# EAGLE schematic vsBenchPowerSupply (EAGLE 7.7.0)

## Sheet 1 of 4: Overview
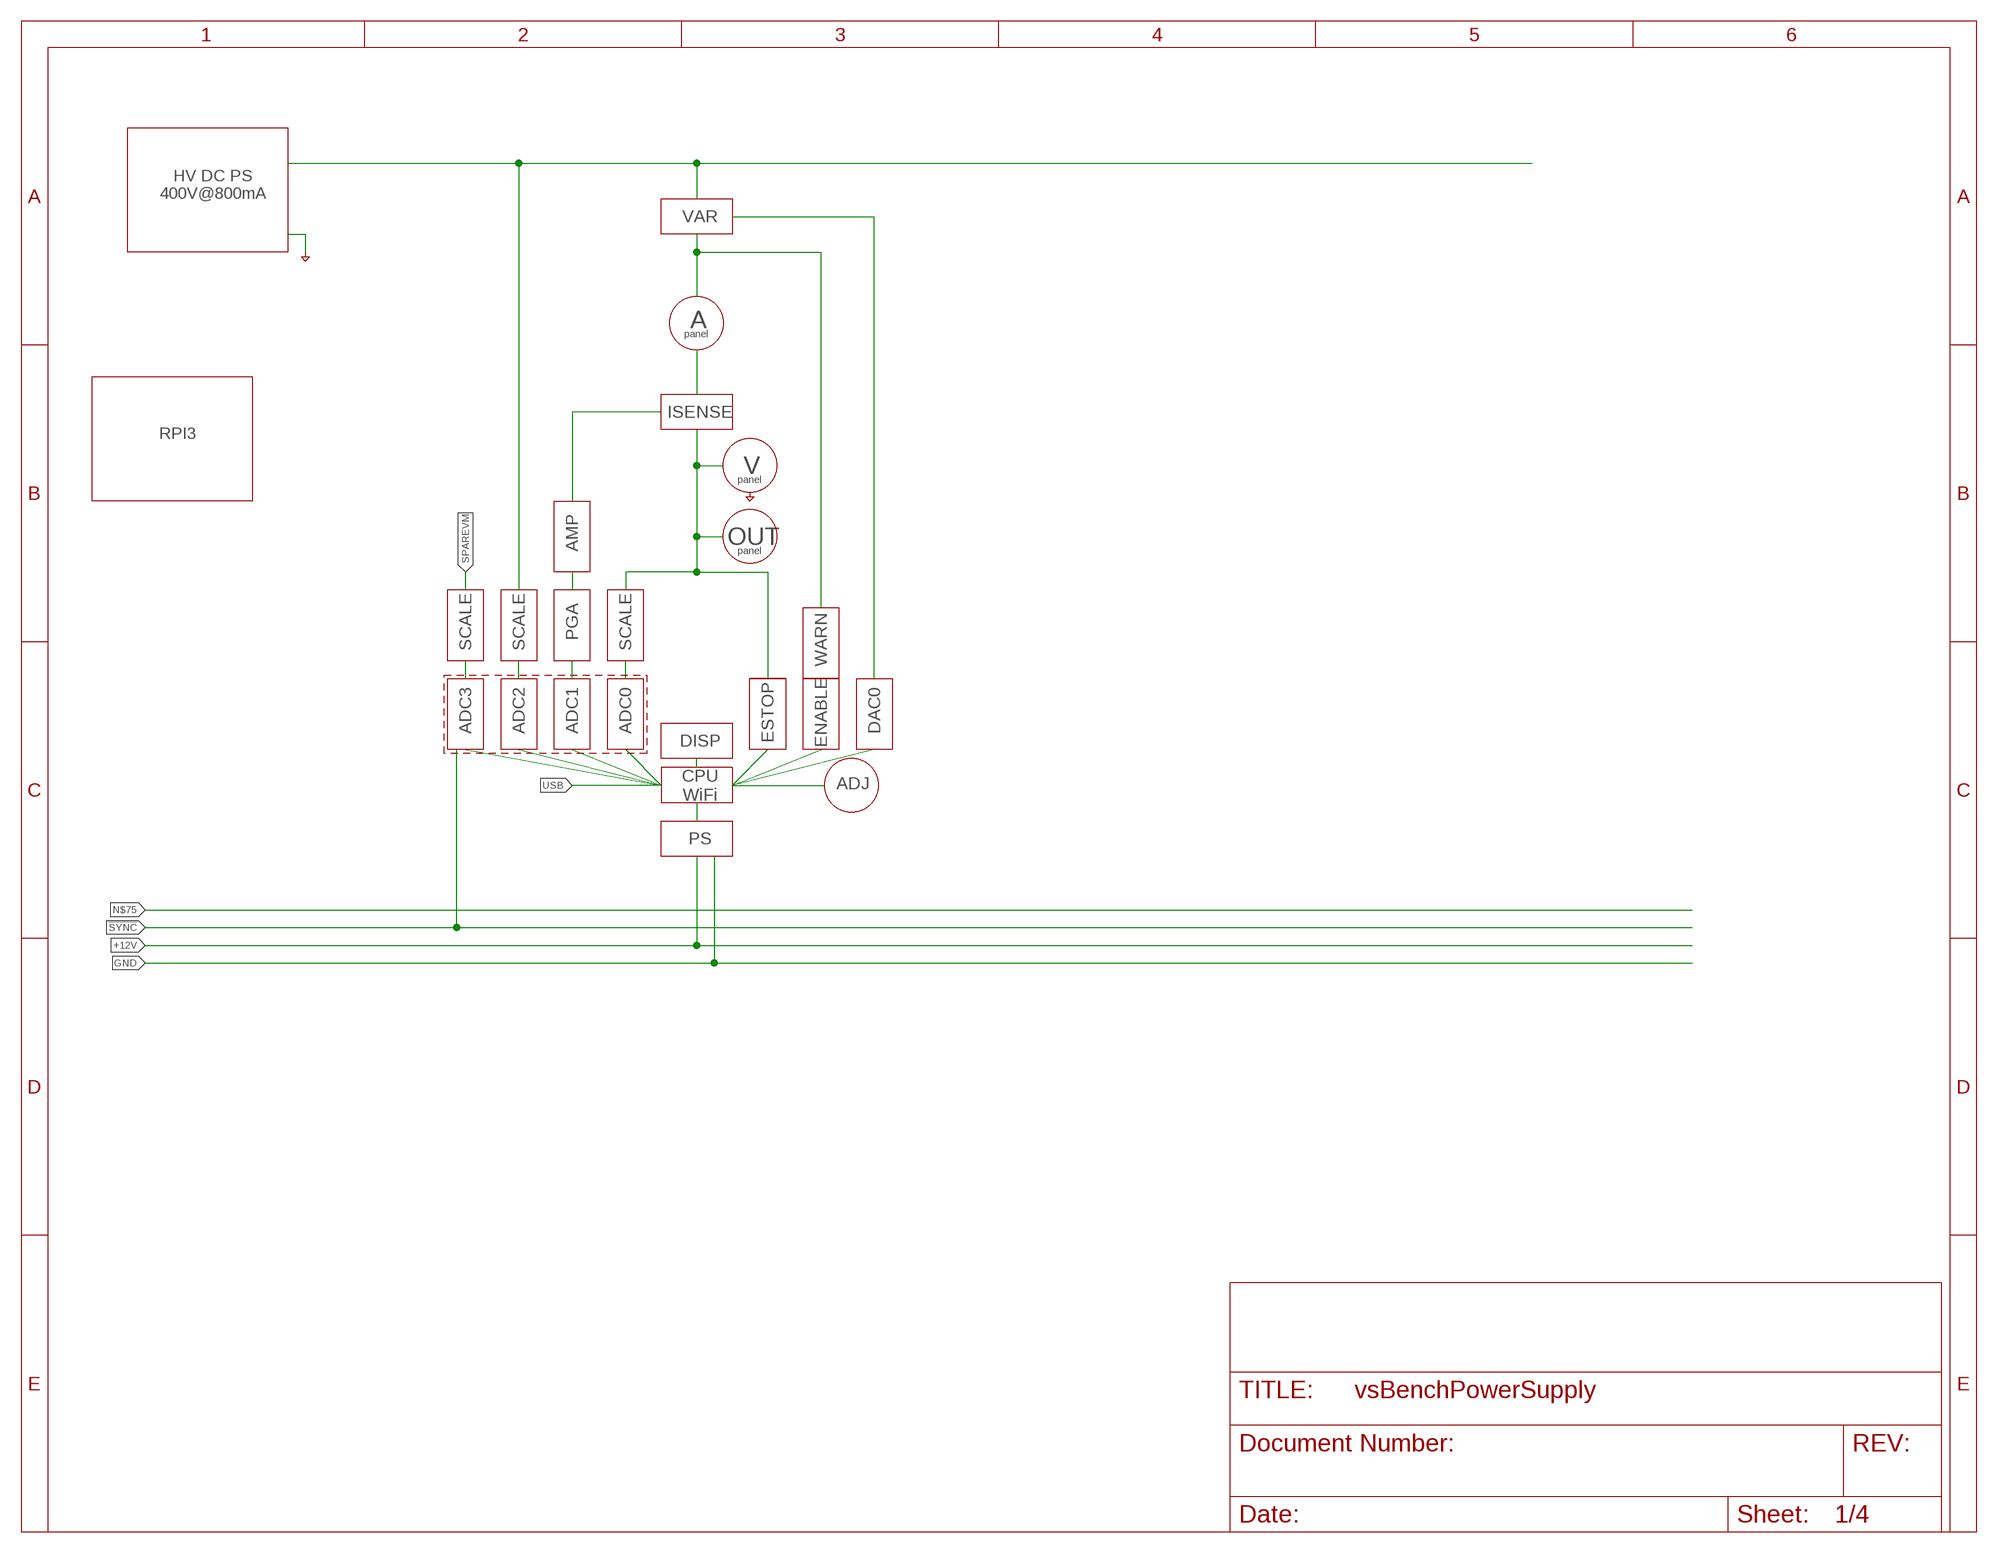
[diagram p0: schematic, sheet 1]

### Notes on the sheet
- HV DC PS
  400V@800mA
- VAR
- A
- panel
- ISENSE
- RPI3
- V
- panel
- AMP | OUT
- panel
- SCALE | SCALE | PGA | SCALE
- WARN
- ADC3 | ADC2 | ADC1 | ADC0 | ESTOP | ENABLE | DAC0
- DISP
- ADJ
- CPU
  WiFi
- PS

## Sheet 2 of 4: Switcher
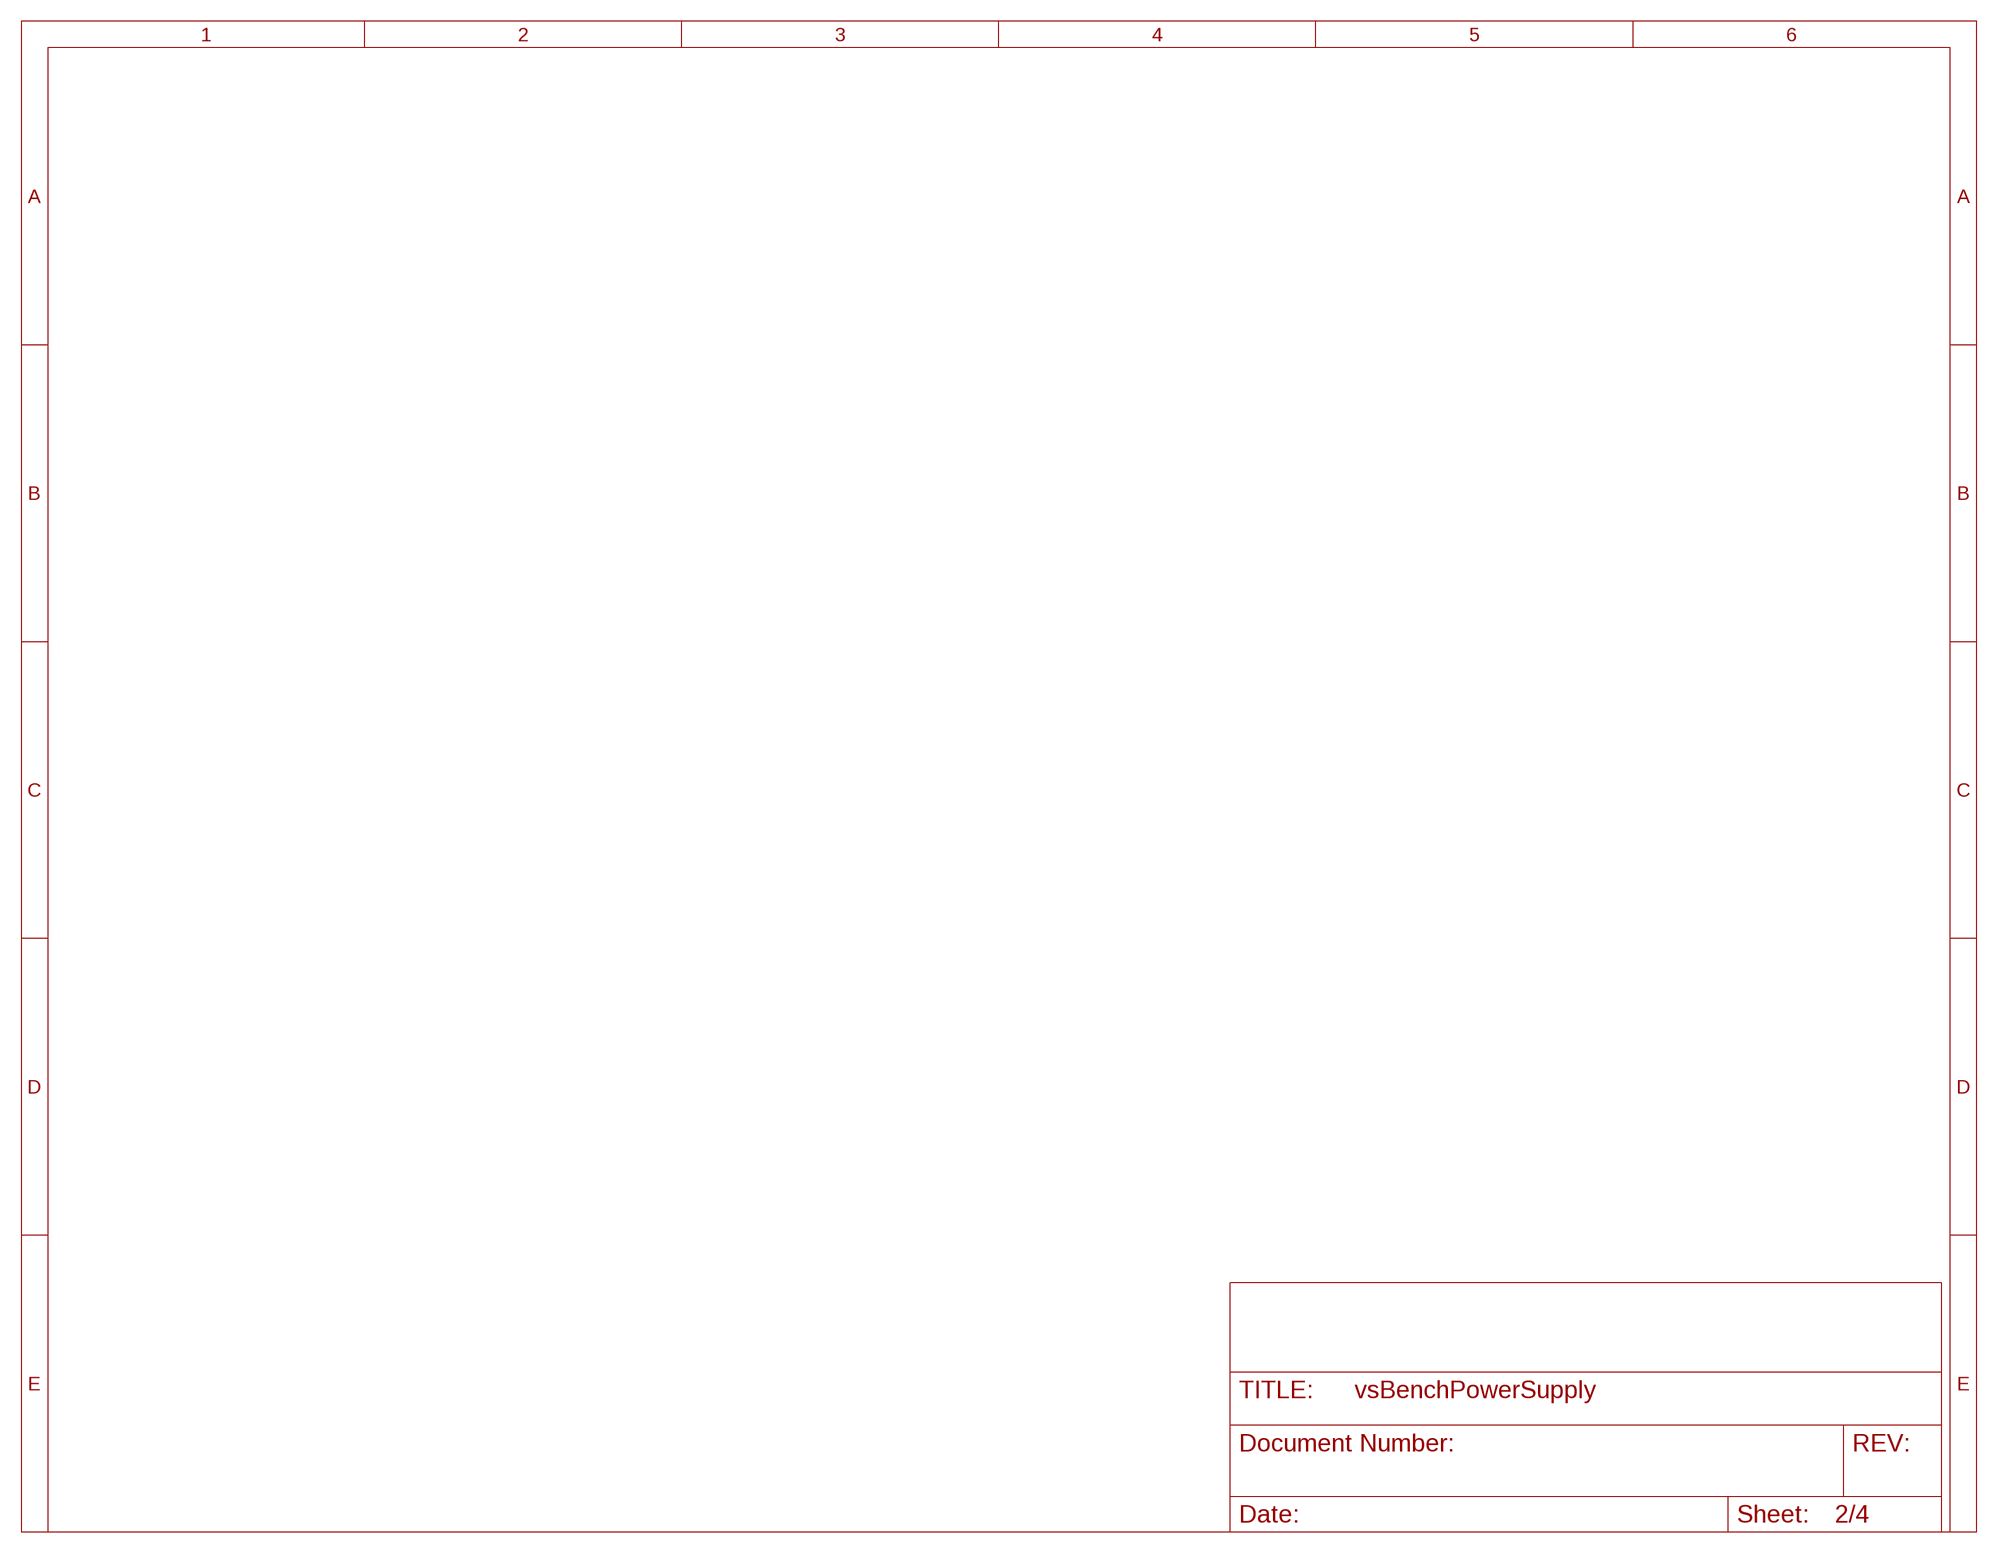
[diagram p1: schematic, sheet 2]

## Sheet 3 of 4: Old School
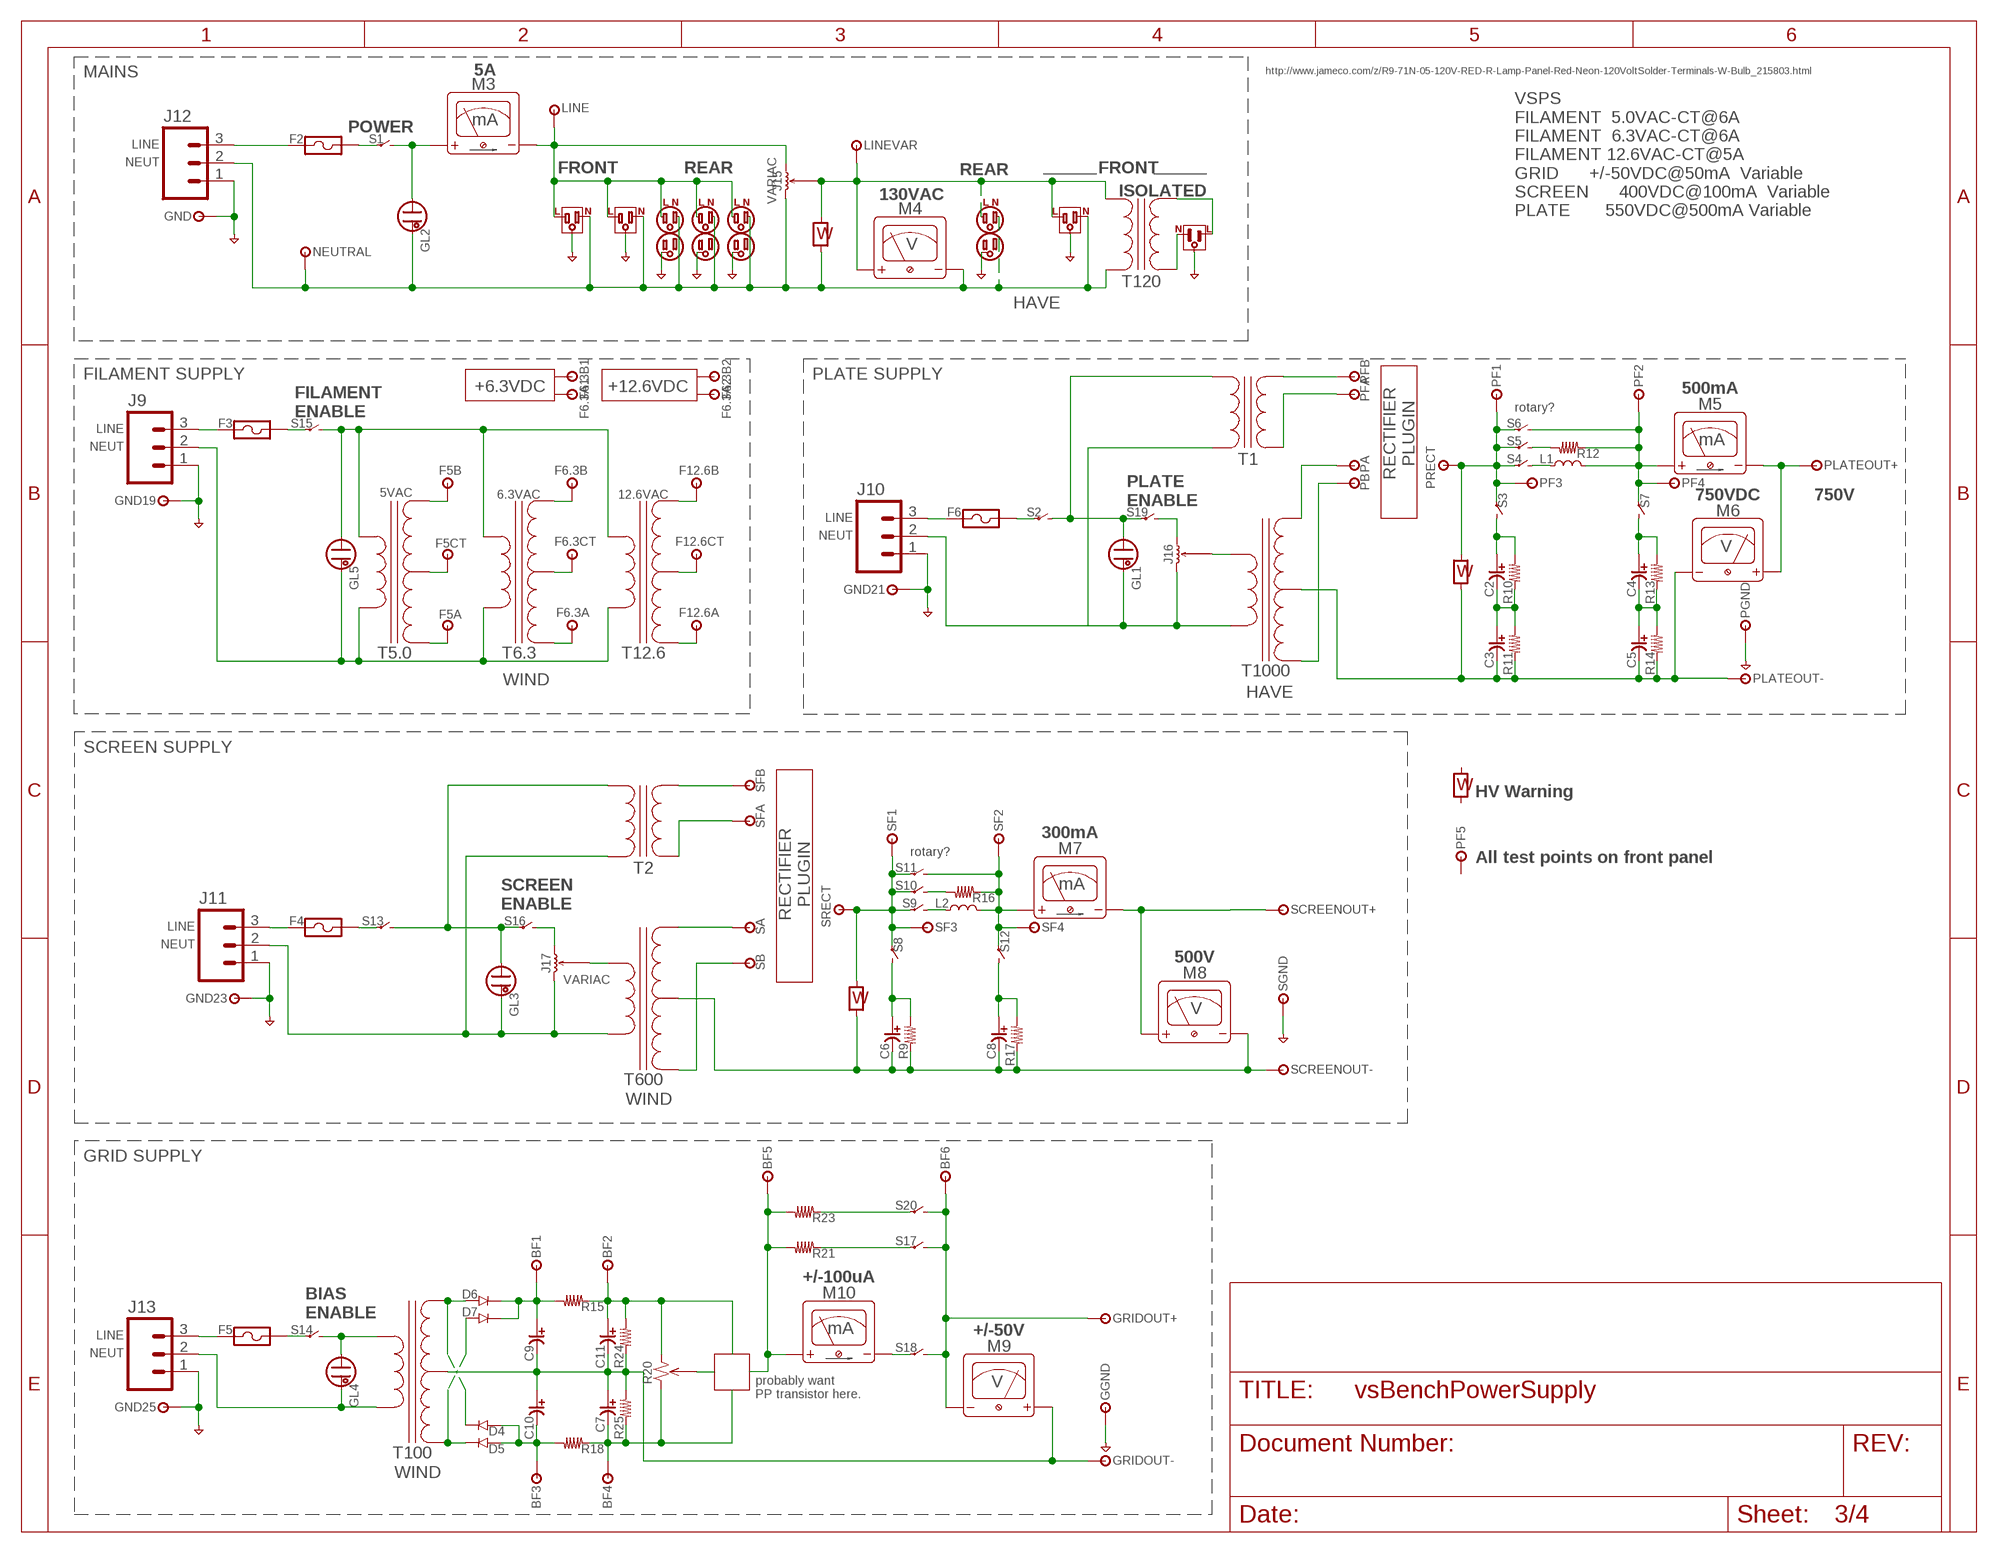
[diagram p2: schematic, sheet 3]

### Parts
BF1  TESTPOINTTHRU  [TPTHRU]
BF2  TESTPOINTTHRU  [TPTHRU]
BF3  TESTPOINTTHRU  [TPTHRU]
BF4  TESTPOINTTHRU  [TPTHRU]
BF5  TESTPOINTTHRU  [TPTHRU]
BF6  TESTPOINTTHRU  [TPTHRU]
C2  C-POLARIZED-SMD-E-3MM  [E-3]
C3  C-POLARIZED-SMD-E-3MM  [E-3]
C4  C-POLARIZED-SMD-E-3MM  [E-3]
C5  C-POLARIZED-SMD-E-3MM  [E-3]
C6  C-POLARIZED-SMD-E-3MM  [E-3]
C7  C-POLARIZED-SMD-E-3MM  [E-3]
C8  C-POLARIZED-SMD-E-3MM  [E-3]
C9  C-POLARIZED-SMD-E-3MM  [E-3]
C10  C-POLARIZED-SMD-E-3MM  [E-3]
C11  C-POLARIZED-SMD-E-3MM  [E-3]
D4  DIODE-1N4148  [DO-35]
D5  DIODE-1N4148  [DO-35]
D6  DIODE-1N4148  [DO-35]
D7  DIODE-1N4148  [DO-35]
F2  FUSE-HOLDER-3557-2  [3557-2]
F3  FUSE-HOLDER-3557-2  [3557-2]
F4  FUSE-HOLDER-3557-2  [3557-2]
F5  FUSE-HOLDER-3557-2  [3557-2]
F5A  TESTPOINTTHRU  [TPTHRU]
F5B  TESTPOINTTHRU  [TPTHRU]
F5CT  TESTPOINTTHRU  [TPTHRU]
F6  FUSE-HOLDER-3557-2  [3557-2]
F6.3A  TESTPOINTTHRU  [TPTHRU]
F6.3A1  TESTPOINTTHRU  [TPTHRU]
F6.3A2  TESTPOINTTHRU  [TPTHRU]
F6.3B  TESTPOINTTHRU  [TPTHRU]
F6.3B1  TESTPOINTTHRU  [TPTHRU]
F6.3B2  TESTPOINTTHRU  [TPTHRU]
F6.3CT  TESTPOINTTHRU  [TPTHRU]
F12.6A  TESTPOINTTHRU  [TPTHRU]
F12.6B  TESTPOINTTHRU  [TPTHRU]
F12.6CT  TESTPOINTTHRU  [TPTHRU]
GGND  TESTPOINTTHRU  [TPTHRU]
GL1  INDICATOR-NEON-BULB-NE2-DRILL  [NE2-NEON-BULB-DRILL]
GL2  INDICATOR-NEON-BULB-NE2-DRILL  [NE2-NEON-BULB-DRILL]
GL3  INDICATOR-NEON-BULB-NE2-DRILL  [NE2-NEON-BULB-DRILL]
GL4  INDICATOR-NEON-BULB-NE2-DRILL  [NE2-NEON-BULB-DRILL]
GL5  INDICATOR-NEON-BULB-NE2-DRILL  [NE2-NEON-BULB-DRILL]
GND  TESTPOINTTHRU  [TPTHRU]
GND19  TESTPOINTTHRU  [TPTHRU]
GND21  TESTPOINTTHRU  [TPTHRU]
GND23  TESTPOINTTHRU  [TPTHRU]
GND25  TESTPOINTTHRU  [TPTHRU]
GRIDOUT+  TESTPOINTTHRU  [TPTHRU]
GRIDOUT-  TESTPOINTTHRU  [TPTHRU]
J3  OUTLET-RECEPTABLE-SINGLE  [CONN-3.81MM-KF2EDG-3]
J4  OUTLET-RECEPTABLE-SINGLE  [CONN-3.81MM-KF2EDG-3]
J5  OUTLET-RECEPTABLE-SINGLE  [CONN-3.81MM-KF2EDG-3]
J6  METER-PANEL-HV-WARNING  [CONN-.100-2]
J7  METER-PANEL-HV-WARNING  [CONN-.100-2]
J8  METER-PANEL-HV-WARNING  [CONN-.100-2]
J9  CONN-03-3.81MM-PLUGIN-SCREW  [CONN-3.81MM-KF2EDG-3]
J10  CONN-03-3.81MM-PLUGIN-SCREW  [CONN-3.81MM-KF2EDG-3]
J11  CONN-03-3.81MM-PLUGIN-SCREW  [CONN-3.81MM-KF2EDG-3]
J12  CONN-03-3.81MM-PLUGIN-SCREW  [CONN-3.81MM-KF2EDG-3]
J13  CONN-03-3.81MM-PLUGIN-SCREW  [CONN-3.81MM-KF2EDG-3]
J14  METER-PANEL-HV-WARNING  [CONN-.100-2]
J15  VARIAC  [CONN-.100-3]
J16  VARIAC  [CONN-.100-3]
J17  VARIAC  [CONN-.100-3]
J18  OUTLET-RECEPTABLE-SINGLE  [CONN-3.81MM-KF2EDG-3]
L1  INDUCTOR-0805  [R0805]
L2  INDUCTOR-0805  [R0805]
LINE  TESTPOINTTHRU  [TPTHRU]
LINEVAR  TESTPOINTTHRU  [TPTHRU]
M3  METER-PANEL-ANALOG-CURRENT-PLUGIN-3.81MM  [CONN-3.81MM-KF2EDG-2]
M4  METER-PANEL-ANALOG-VOLTAGE-PLUGIN-3.81MM  [CONN-3.81MM-KF2EDG-2]
M5  METER-PANEL-ANALOG-CURRENT-PLUGIN-3.81MM  [CONN-3.81MM-KF2EDG-2]
M6  METER-PANEL-ANALOG-VOLTAGE-PLUGIN-3.81MM  [CONN-3.81MM-KF2EDG-2]
M7  METER-PANEL-ANALOG-CURRENT-PLUGIN-3.81MM  [CONN-3.81MM-KF2EDG-2]
M8  METER-PANEL-ANALOG-VOLTAGE-PLUGIN-3.81MM  [CONN-3.81MM-KF2EDG-2]
M9  METER-PANEL-ANALOG-VOLTAGE-PLUGIN-3.81MM  [CONN-3.81MM-KF2EDG-2]
M10  METER-PANEL-ANALOG-CURRENT-PLUGIN-3.81MM  [CONN-3.81MM-KF2EDG-2]
NEUTRAL  TESTPOINTTHRU  [TPTHRU]
PA  TESTPOINTTHRU  [TPTHRU]
PB  TESTPOINTTHRU  [TPTHRU]
PF1  TESTPOINTTHRU  [TPTHRU]
PF2  TESTPOINTTHRU  [TPTHRU]
PF3  TESTPOINTTHRU  [TPTHRU]
PF4  TESTPOINTTHRU  [TPTHRU]
PF5  TESTPOINTTHRU  [TPTHRU]
PFA  TESTPOINTTHRU  [TPTHRU]
PFB  TESTPOINTTHRU  [TPTHRU]
PGND  TESTPOINTTHRU  [TPTHRU]
PLATEOUT+  TESTPOINTTHRU  [TPTHRU]
PLATEOUT-  TESTPOINTTHRU  [TPTHRU]
PRECT  TESTPOINTTHRU  [TPTHRU]
R9  R-0402  [R0402]
R10  R-0402  [R0402]
R11  R-0402  [R0402]
R12  R-0402  [R0402]
R13  R-0402  [R0402]
R14  R-0402  [R0402]
R15  R-0402  [R0402]
R16  R-0402  [R0402]
R17  R-0402  [R0402]
R18  R-0402  [R0402]
R20  POTENTIOMETER  [CONN-.100-3]
R21  R-0402  [R0402]
R23  R-0402  [R0402]
R24  R-0402  [R0402]
R25  R-0402  [R0402]
S1  SWITCH-PANEL-SPST  [CONN-.100-2]
S2  SWITCH-PANEL-SPST  [CONN-.100-2]
S3  SWITCH-PANEL-SPST  [CONN-.100-2]
S4  SWITCH-PANEL-SPST  [CONN-.100-2]
S5  SWITCH-PANEL-SPST  [CONN-.100-2]
S6  SWITCH-PANEL-SPST  [CONN-.100-2]
S7  SWITCH-PANEL-SPST  [CONN-.100-2]
S8  SWITCH-PANEL-SPST  [CONN-.100-2]
S9  SWITCH-PANEL-SPST  [CONN-.100-2]
S10  SWITCH-PANEL-SPST  [CONN-.100-2]
S11  SWITCH-PANEL-SPST  [CONN-.100-2]
S12  SWITCH-PANEL-SPST  [CONN-.100-2]
S13  SWITCH-PANEL-SPST  [CONN-.100-2]
S14  SWITCH-PANEL-SPST  [CONN-.100-2]
S15  SWITCH-PANEL-SPST  [CONN-.100-2]
S16  SWITCH-PANEL-SPST  [CONN-.100-2]
S17  SWITCH-PANEL-SPST  [CONN-.100-2]
S18  SWITCH-PANEL-SPST  [CONN-.100-2]
S19  SWITCH-PANEL-SPST  [CONN-.100-2]
S20  SWITCH-PANEL-SPST  [CONN-.100-2]
SA  TESTPOINTTHRU  [TPTHRU]
SB  TESTPOINTTHRU  [TPTHRU]
SCREENOUT+  TESTPOINTTHRU  [TPTHRU]
SCREENOUT-  TESTPOINTTHRU  [TPTHRU]
SF1  TESTPOINTTHRU  [TPTHRU]
SF2  TESTPOINTTHRU  [TPTHRU]
SF3  TESTPOINTTHRU  [TPTHRU]
SF4  TESTPOINTTHRU  [TPTHRU]
SFA  TESTPOINTTHRU  [TPTHRU]
SFB  TESTPOINTTHRU  [TPTHRU]
SGND  TESTPOINTTHRU  [TPTHRU]
SRECT  TESTPOINTTHRU  [TPTHRU]
T1  TRANSFORMER-2-2  [TRANSFORMER-4-2-G]
T2  TRANSFORMER-2-2  [TRANSFORMER-4-2-G]
T5.0  TRANSFORMER-3-2  [CONN-.100-5]
T6.3  TRANSFORMER-3-2  [CONN-.100-5]
T12.6  TRANSFORMER-3-2  [CONN-.100-5]
T100  TRANSFORMER-3-2  [CONN-.100-5]
T120  TRANSFORMER-2-2  [TRANSFORMER-4-2-G]
T600  TRANSFORMER-3-2  [CONN-.100-5]
T1000  TRANSFORMER-3-2  [CONN-.100-5]
U$1  OUTLET-RECEPTACLE  [CONN-3.81MM-KF2EDG-3]
U$2  OUTLET-RECEPTACLE  [CONN-3.81MM-KF2EDG-3]
U$3  OUTLET-RECEPTACLE  [CONN-3.81MM-KF2EDG-3]
U$4  OUTLET-RECEPTACLE  [CONN-3.81MM-KF2EDG-3]

### Nets
BIASOUT: BF6.1 GRIDOUT+.1 M9.1(-) S17.2 S18.2 S20.2
F6.3B: F6.3B.1 T6.3.3(P1)
GND: GGND.1 GND19.1 GND21.1 GND23.1 GND25.1 GND.1 J3.1(GND) J4.1(GND) J5.1(GND) J9.1 J10.1 J11.1 J12.1 J13.1 J18.1(GND) PGND.1 SGND.1 U$1.1(GND) U$2.1(GND) U$3.1(GND) U$4.1(GND) ; also sheet 1,4
HVOUT: M5.1(-) M6.2(+) PLATEOUT+.1
LINE: J3.3(LINE) J15.3 J18.3(LINE) LINE.1 M3.1(-) U$1.3(LINE) U$2.3(LINE) U$3.3(LINE)
LINEVAR: J5.3(LINE) J6.1 J15.2(W) LINEVAR.1 M4.2(+) T120.1 U$4.3(LINE)
N$10: C2.+ R10.2 S3.2
N$11: L1.1 M5.2(+) PF2.1 PF4.1 R12.1 S6.2 S7.1
N$12: C2.- C3.+ R10.1 R11.2
N$13: L1.2 S4.2
N$14: R12.2 S5.2
N$15: J17.2(W) T600.1(S1)
N$16: C4.+ R13.2 S7.2
N$17: GL1.1(A) S2.2 S19.1 T1.1
N$18: C4.- C5.+ R13.1 R14.2
N$19: F2.1@1 F2.1@2 J12.3
N$20: GL3.1(A) S13.2 S16.1 T2.1
N$21: C6.+ R9.2 S8.2
N$22: F2.2@1 F2.2@2 S1.1
N$23: GL5.1(A) S15.2 T5.0.1(S1) T6.3.1(S1) T12.6.1(S1)
N$24: GL2.1(A) M3.2(+) S1.2
N$25: L2.2 S9.2
N$26: BF5.1 M10.2(+) R21.2 R23.2
N$27: D5.C D7.A T100.5(P2)
N$28: R16.2 S10.2
N$29: C8.+ R17.2 S12.2
N$30: J4.3(LINE) T120.5(S1)
N$31: BF2.1 C11.+ R15.1 R20.3 R24.2
N$32: L2.1 M7.2(+) R16.1 S11.2 S12.1 SF2.1 SF4.1
N$33: R21.1 S17.1
N$34: BF1.1 C9.+ D6.C D7.C R15.2
N$35: J4.2(NEU) T120.6(S2)
N$36: F5.2@1 F5.2@2 S14.1
N$37: GL4.1(A) S14.2 T100.1(S1)
N$38: F3.1@1 F3.1@2 J9.3
N$39: F4.2@1 F4.2@2 S13.1
N$40: F6.1@1 F6.1@2 J10.3
N$41: F3.2@1 F3.2@2 S15.1
N$42: BF3.1 C10.- D4.A D5.A R18.2
N$43: F5.1@1 F5.1@2 J13.3
N$44: F6.2@1 F6.2@2 S2.1
N$45: J16.2(W) T1000.1(S1)
N$46: J17.3 S16.2
N$47: PFB.1 T1.5(S1)
N$48: PFA.1 T1.6(S2)
N$49: J16.3 S19.2
N$50: R20.2(W)
N$51: M10.1(-) S18.1
N$52: SFB.1 T2.5(S1)
N$53: SFA.1 T2.6(S2)
N$54: F4.1@1 F4.1@2 J11.3
N$55: BF4.1 C7.- R18.1 R20.1 R25.1
N$56: C7.+ C9.- C10.+ C11.- GRIDOUT-.1 M9.2(+) R24.1 R25.2 T100.4(PCT)
N$57: D4.C D6.A T100.3(P1)
N$58: R23.1 S20.1
NEUTRAL: GL1.2(A1) GL2.2(A1) GL3.2(A1) GL4.2(A1) GL5.2(A1) J3.2(NEU) J5.2(NEU) J6.2 J9.2 J10.2 J11.2 J12.2 J13.2 J15.1 J16.1 J17.1 J18.2(NEU) M4.1(-) NEUTRAL.1 T1.2 T2.2 T5.0.2(S2) T6.3.2(S2) T12.6.2(S2) T100.2(S2) T120.2 T600.2(S2) T1000.2(S2) U$1.2(NEU) U$2.2(NEU) U$3.2(NEU) U$4.2(NEU)
PA: PA.1 T1000.3(P1)
PB: PB.1 T1000.5(P2)
PLATECT: C3.- C5.- J7.2 M6.1(-) PLATEOUT-.1 R11.1 R14.1 T1000.4(PCT)
PRECT: J7.1 PF1.1 PF3.1 PRECT.1 S3.1 S4.1 S5.1 S6.1
SA: SA.1 T600.3(P1)
SB: SB.1 T600.5(P2)
SCREENCT: C6.- C8.- J8.2 M8.1(-) R9.1 R17.1 SCREENOUT-.1 T600.4(PCT)
SCREENOUT: M7.1(-) M8.2(+) SCREENOUT+.1
SRECT: J8.1 S8.1 S9.1 S10.1 S11.1 SF1.1 SF3.1 SRECT.1
VFIL5A: F5A.1 T5.0.5(P2)
VFIL5B: F5B.1 T5.0.3(P1)
VFIL5CT: F5CT.1 T5.0.4(PCT)
VFIL6A: F6.3A.1 T6.3.5(P2)
VFIL6CT: F6.3CT.1 T6.3.4(PCT)
VFIL12A: F12.6A.1 T12.6.5(P2)
VFIL12B: F12.6B.1 T12.6.3(P1)
VFIL12CT: F12.6CT.1 T12.6.4(PCT)
Unconnected: F6.3A1.1 F6.3A2.1 F6.3B1.1 F6.3B2.1 J14.1 J14.2 PF5.1

### Notes on the sheet
- 5A | http://www.jameco.com/z/R9-71N-05-120V-RED-R-Lamp-Panel-Red-Neon-120VoltSolder-Terminals-W-Bulb_215803.html
- MAINS
- VSPS
  FILAMENT  5.0VAC-CT@6A
  FILAMENT  6.3VAC-CT@6A
  FILAMENT 12.6VAC-CT@5A
  GRID      +/-50VDC@50mA  Variable
  SCREEN      400VDC@100mA  Variable
  PLATE       550VDC@500mA Variable
- POWER
- LINE
- NEUT
- FRONT | REAR | REAR | FRONT
- 130VAC | ISOLATED
- VARIAC
- HAVE
- FILAMENT SUPPLY | PLATE SUPPLY
- +6.3VDC | +12.6VDC | 500mA
- rotary?
- FILAMENT
  ENABLE
- LINE
- RECTIFIER
  PLUGIN
- NEUT
- 5VAC | 6.3VAC | 12.6VAC
- 750VDC | 750V
- PLATE
  ENABLE
- LINE
- NEUT
- WIND
- HAVE
- SCREEN SUPPLY
- HV Warning
- 300mA
- rotary?
- All test points on front panel
- RECTIFIER
  PLUGIN
- SCREEN
  ENABLE
- LINE
- NEUT
- 500V
- VARIAC
- WIND
- GRID SUPPLY
- +/-100uA
- BIAS
  ENABLE
- +/-50V
- LINE
- NEUT
- probably want
  PP transistor here.
- WIND

## Sheet 4 of 4
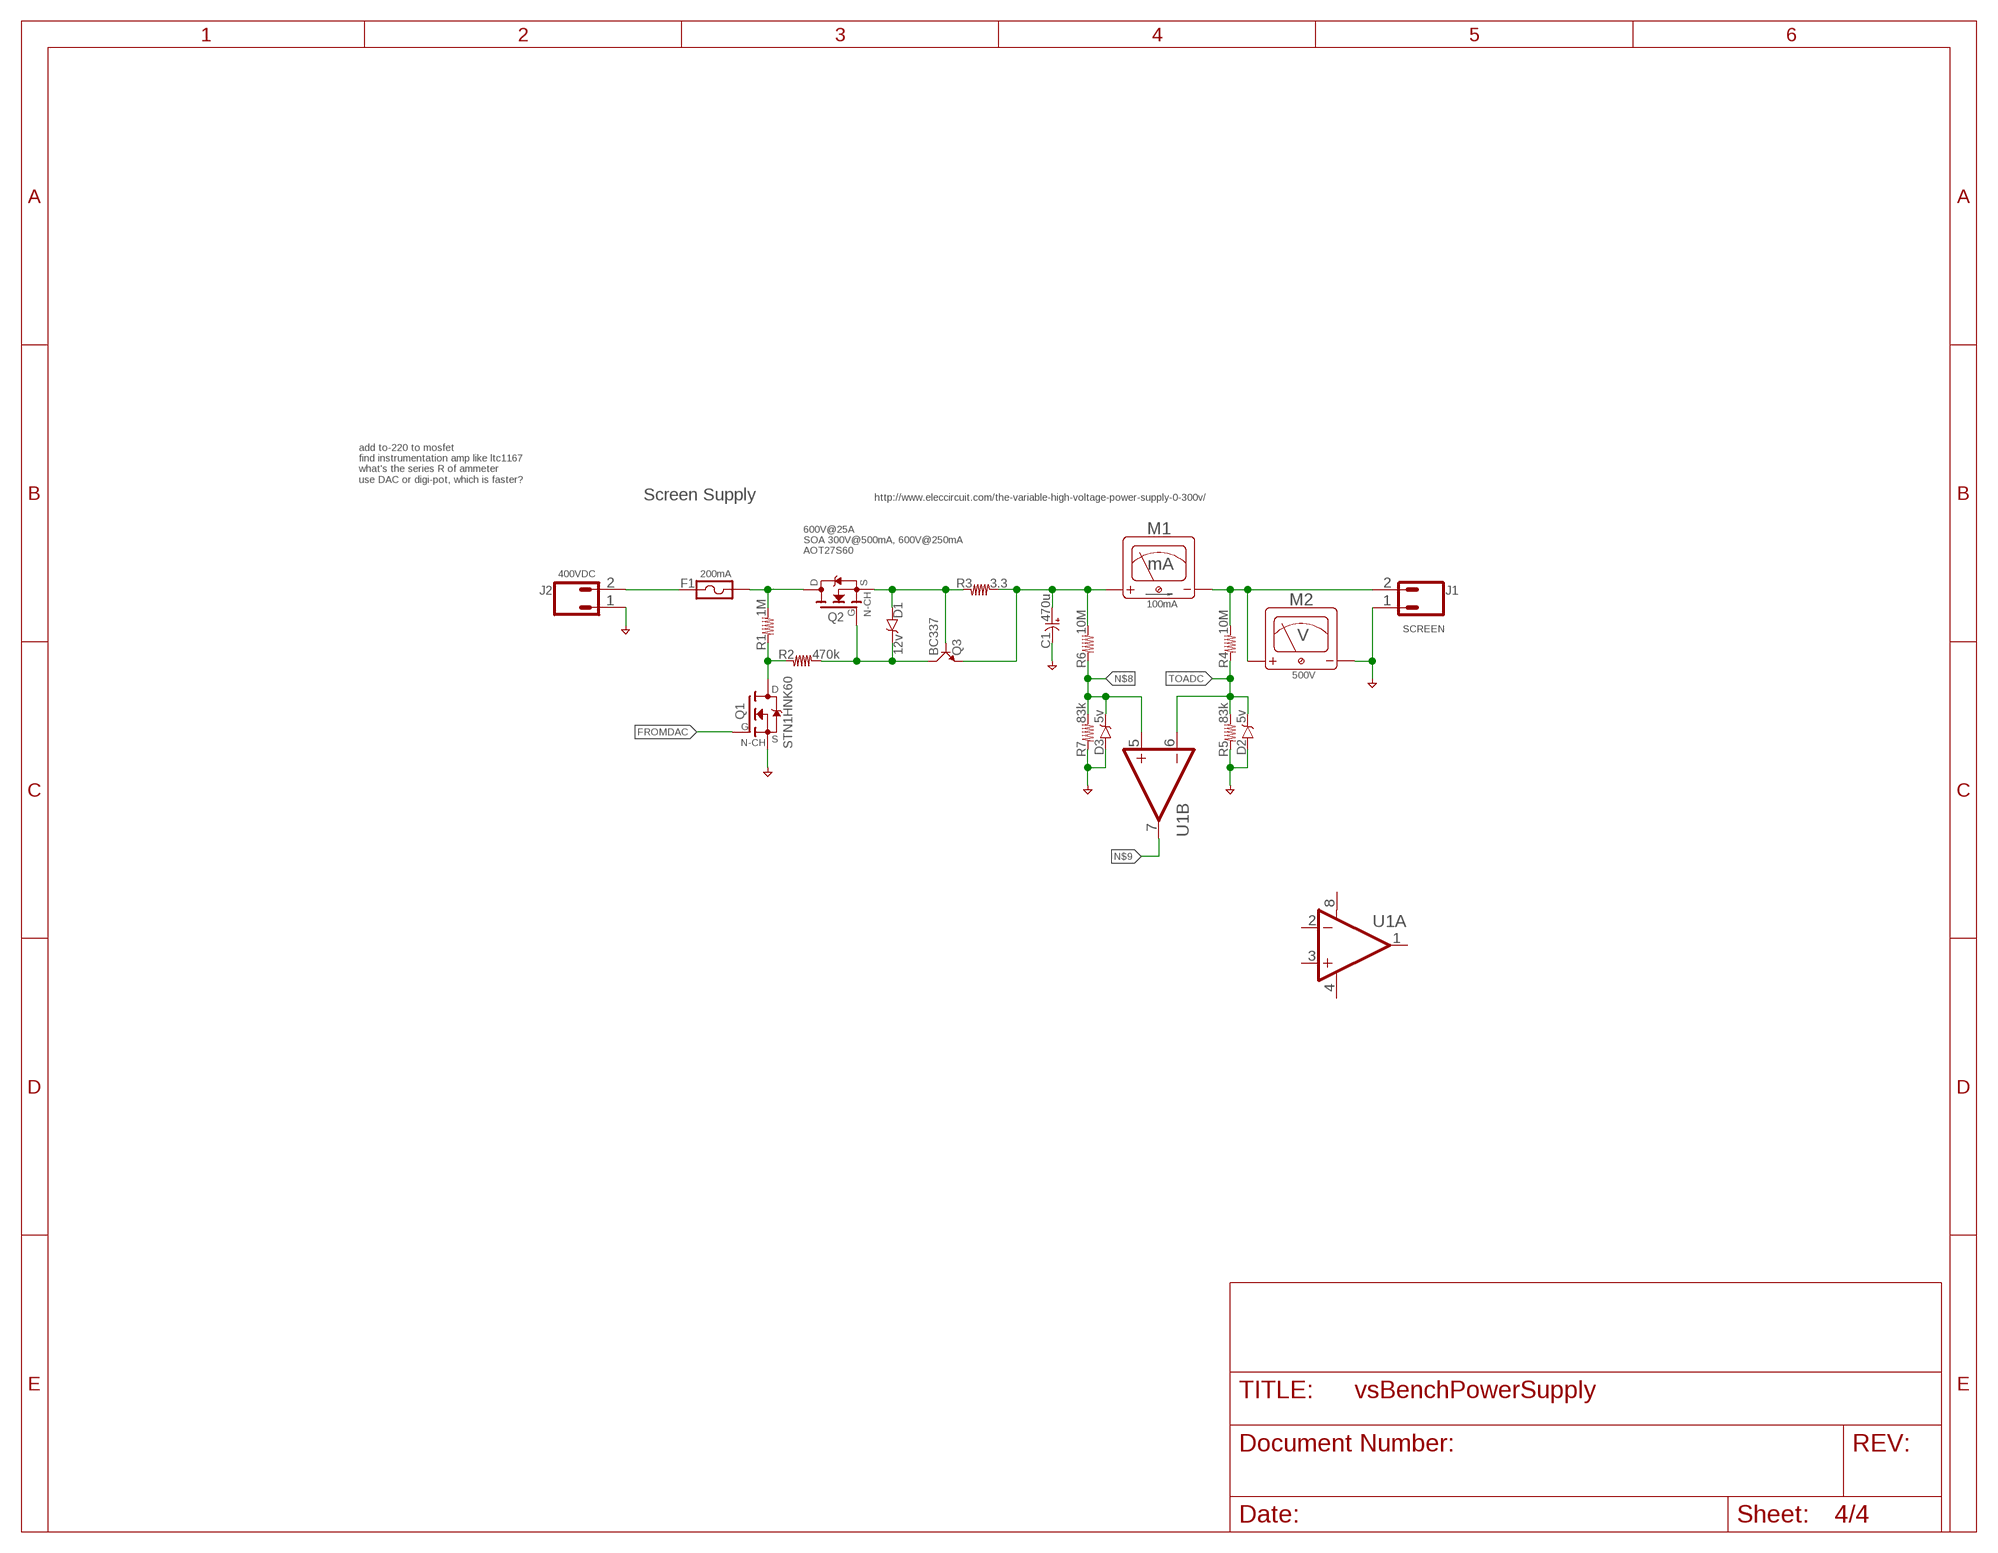
[diagram p3: schematic, sheet 4]

### Parts
C1  470u  C-E5-10.5  [E5-10,5]
D1  12v  DIODE-ZENER-0805  [SOD-323]
D2  5v  DIODE-ZENER-0805  [SOD-323]
D3  5v  DIODE-ZENER-0805  [SOD-323]
F1  FUSE-HOLDER-3557-2  [3557-2]
J1  CONN-02-3.81MM-PLUGIN-SCREW  [CONN-3.81MM-KF2EDG-2]
J2  CONN-02-3.81MM-PLUGIN-SCREW  [CONN-3.81MM-KF2EDG-2]
M1  METER-PANEL-ANALOG-CURRENT-PLUGIN-3.81MM  [CONN-3.81MM-KF2EDG-2]
M2  METER-PANEL-ANALOG-VOLTAGE-PLUGIN-3.81MM  [CONN-3.81MM-KF2EDG-2]
Q1  STN1HNK60  FET-NCH-SOT23  [SOT23-3]
Q2  FET-NCH-TO252  [TO252]
Q3  BC337  TRANSISTOR_NPNSOT23-3  [SOT23-3]
R1  1M  R-2512  [R2512]
R2  470k  R-2512  [R2512]
R3  3.3  R-2512  [R2512]
R4  10M  R-2512  [R2512]
R5  83k  R-2512  [R2512]
R6  10M  R-2512  [R2512]
R7  83k  R-2512  [R2512]
U1  AMP-OPAMP-DUAL-SO08  [SO08]

### Nets
FROMDAC: Q1.1(G)
GND: C1.- D2.A D3.A J1.1 J2.1 M2.1(-) Q1.2(S) R5.1 R7.1 ; also sheet 1,3
N$1: J1.2 M1.1(-) M2.2(+) R4.2
N$2: D1.A Q2.2(S) Q3.1(B) R3.1
N$3: C1.+ M1.2(+) Q3.2(E) R3.2 R6.2
N$4: D1.C Q2.1(G) Q3.3(C) R2.2
N$5: F1.1@1 F1.1@2 J2.2
N$6: Q1.3(D) R1.1 R2.1
N$7: F1.2@1 F1.2@2 Q2.3(D) R1.2
N$8: D3.C R6.1 R7.2 U1.5(B:+IN)
N$9: U1.7(B:OUT)
TOADC: D2.C R4.1 R5.2 U1.6(B:-IN)
Unconnected: U1.1(A:OUT) U1.2(A:-IN) U1.3(A:+IN)

### Notes on the sheet
- add to-220 to mosfet
  find instrumentation amp like ltc1167
  what's the series R of ammeter
  use DAC or digi-pot, which is faster?
- Screen Supply | http://www.eleccircuit.com/the-variable-high-voltage-power-supply-0-300v/
- 600V@25A
  SOA 300V@500mA, 600V@250mA
  AOT27S60
- 400VDC | 200mA
- 100mA
- SCREEN
- 500V

## Power pins joined to a net without a drawn wire
V+: U1.8(A:V+)
V-: U1.4(A:V-)

## Library data of the parts
BF1-BF6 F5A F5B F5CT F6.3A F6.3A1 F6.3A2 F6.3B F6.3B1 F6.3B2 F6.3CT F12.6A F12.6B F12.6CT GGND GND GND19 GND21 GND23 GND25 GRIDOUT+ GRIDOUT- LINE LINEVAR NEUTRAL PA PB PF1-PF5 PFA PFB PGND PLATEOUT+ PLATEOUT- PRECT SA SB SCREENOUT+ SCREENOUT- SF1-SF4 SFA SFB SGND SRECT = holla:TESTPOINT; DNP: 1
C1 = holla:C; DESC: 450v
C2-C11 = holla:C-POLARIZED
D1-D3 = holla:DIODE-ZENER
D4-D7 = holla:DIODE
F1-F6 = holla:FUSE-HOLDER
GL1-GL5 = holla:INDICATOR-NEON-BULB-NE2: Neon indicator (wire connection)
J1 J2 = holla:CONN-02: CONN HEADER 2POS
J3-J5 J18 = holla:OUTLET-RECEPTABLE-SINGLE
J6-J8 J14 = holla:METER-PANEL-HV-WARNING
J9-J13 = holla:CONN-03
J15-J17 = holla:VARIAC
L1 L2 = holla:INDUCTOR
M1 M3 M5 M7 M10 = holla:METER-PANEL-ANALOG-CURRENT
M2 M4 M6 M8 M9 = holla:METER-PANEL-ANALOG-VOLTAGE
Q1 Q2 = holla:FET-NCH
Q3 = holla:TRANSISTOR_NPN: Transistor NPN BJT configuration in SOT23 package. MMBT2222 is the common NPN we use. Double check BCE configuration again layout.
R1 = holla:R; DESC: 1W
R2 R3 R9-R18 R21 R23-R25 = holla:R; DESC: 5%
R4 R5 R7 = holla:R; DESC: .1%
R6 = holla:R; DESC: ,1%
R20 = holla:POTENTIOMETER
S1-S20 = holla:SWITCH-PANEL-SPST
T1 T2 T120 = holla:TRANSFORMER-2-2: TRANSFORMER 2 x primary, 2 x secondary
T5.0 T6.3 T12.6 T100 T600 T1000 = holla:TRANSFORMER-3-2
U1 = holla:AMP-OPAMP-DUAL: Generic op-amp footprint
U$1-U$4 = holla:OUTLET-RECEPTACLE